# EAGLE schematic doan (EAGLE 9.2.2)
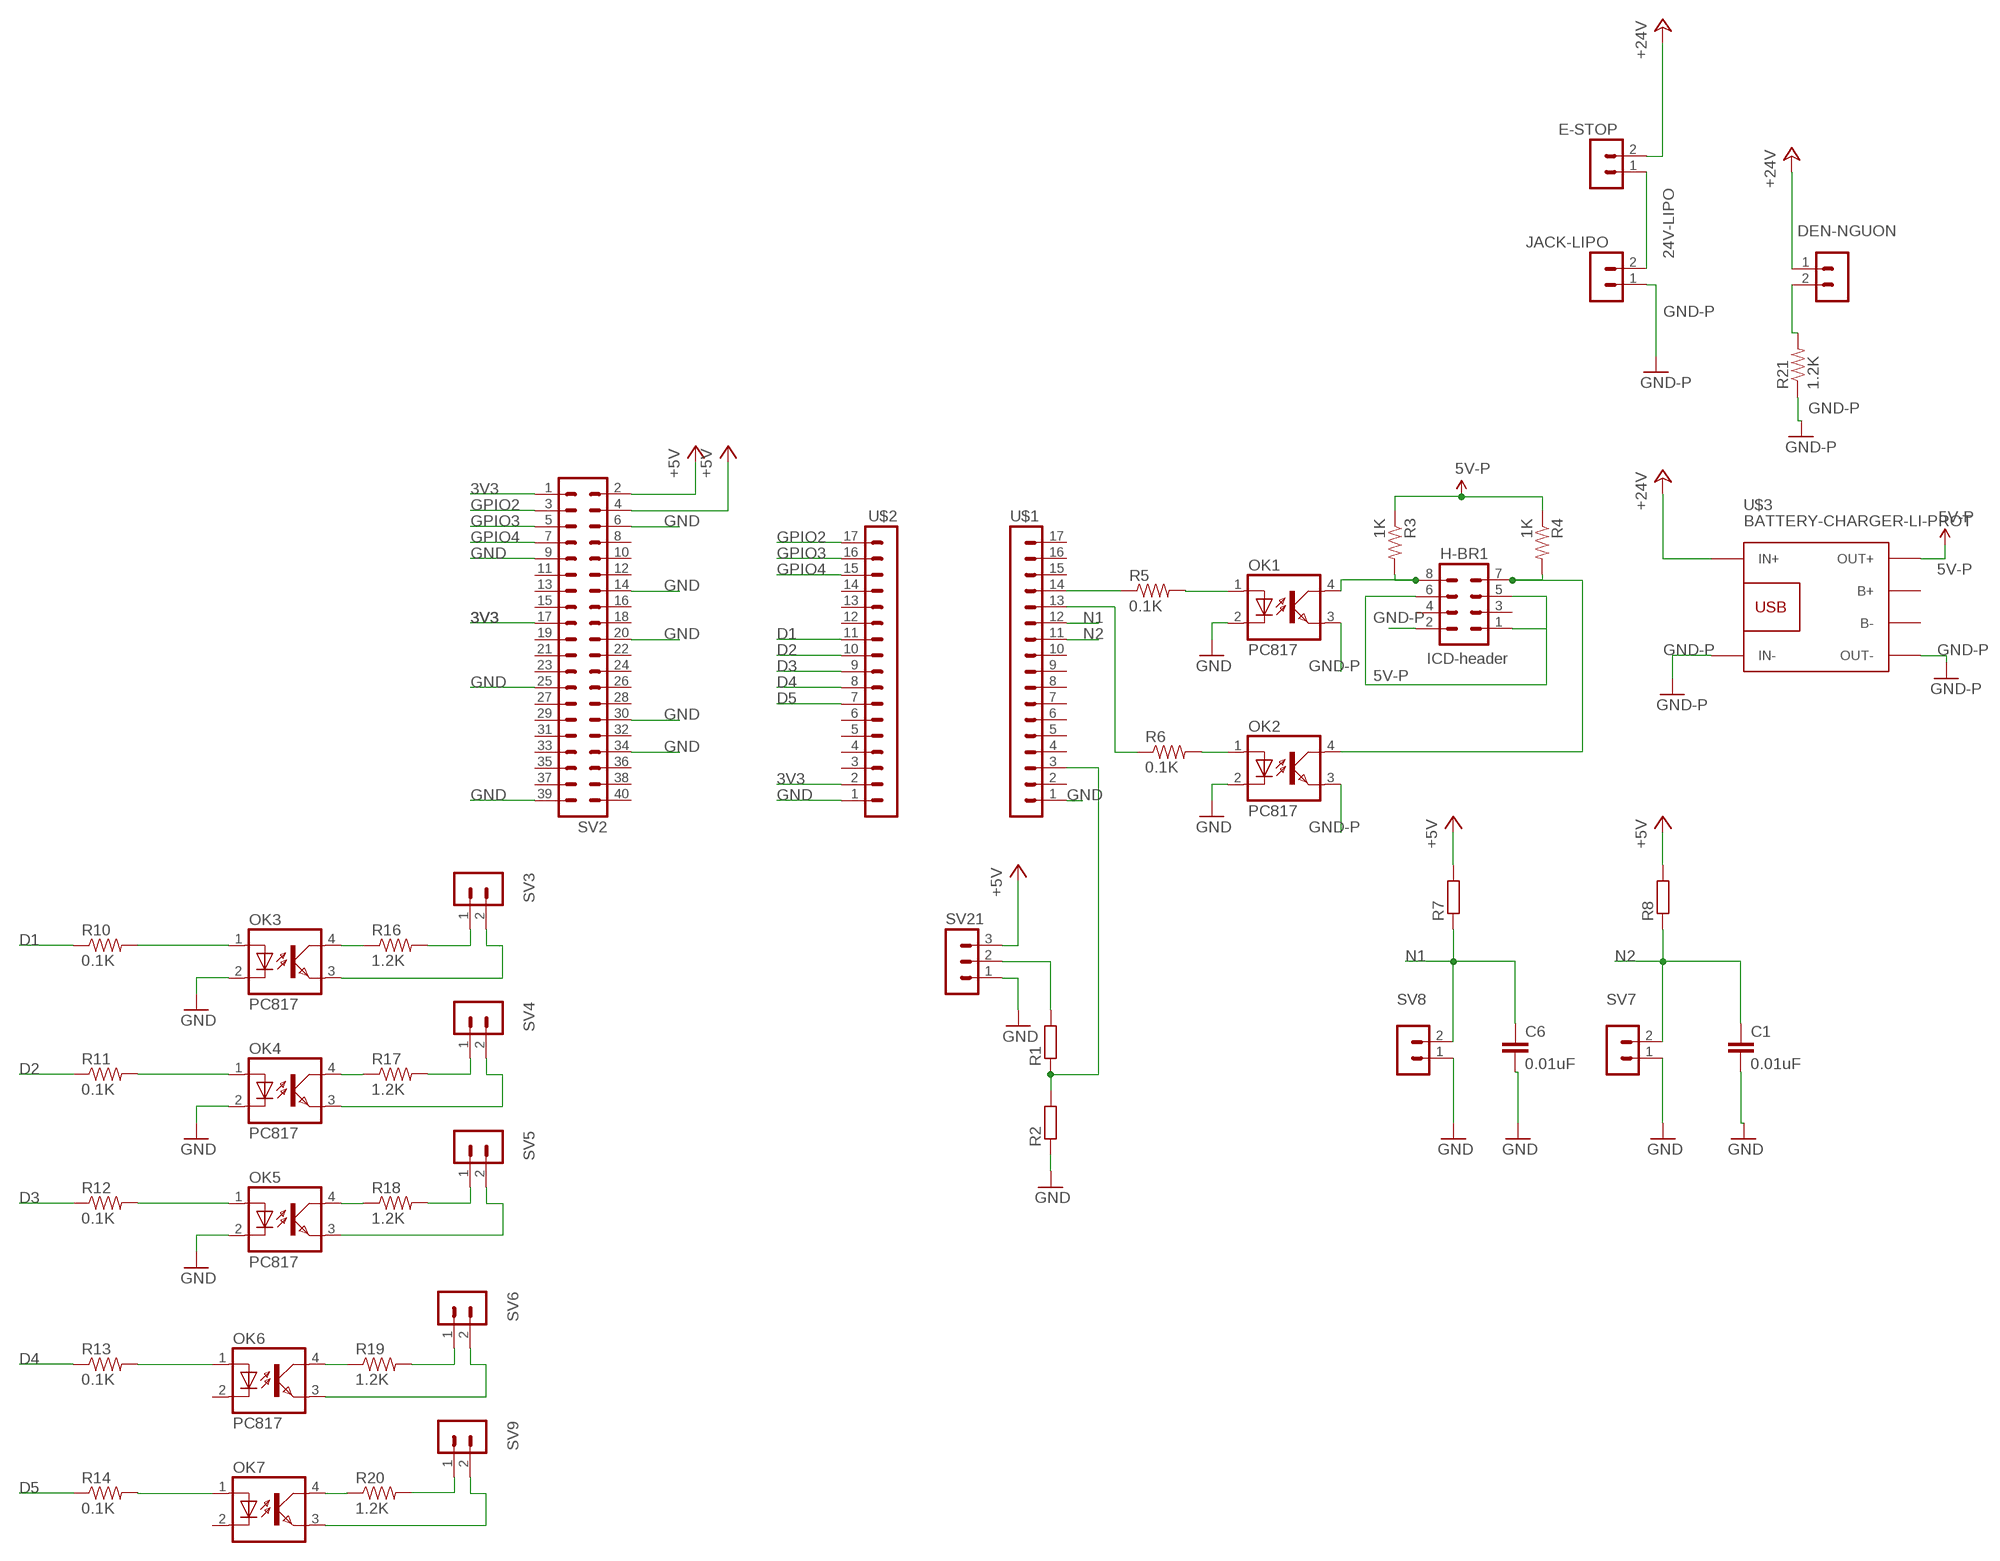
[diagram p0: schematic, sheet 1]

## Parts
C1  0.01uF  10UF10V10%(0805)  [0805-CAP]
C6  0.01uF  10UF10V10%(0805)  [0805-CAP]
DEN-NGUON  MA02-1  [MA02-1]
E-STOP  MA02-1  [MA02-1]
H-BR1  MA04-2  [MA04-2]
JACK-LIPO  MA02-1  [MA02-1]
OK1  PC817  [DIL04]
OK2  PC817  [DIL04]
OK3  PC817  [DIL04]
OK4  PC817  [DIL04]
OK5  PC817  [DIL04]
OK6  PC817  [DIL04]
OK7  PC817  [DIL04]
R1  R-EU_0309/10  [0309/10]
R2  R-EU_0309/10  [0309/10]
R3  1K  0.3OHM-1/8W-1%(0805)  [0805]
R4  1K  0.3OHM-1/8W-1%(0805)  [0805]
R5  0.1K  0.3OHM-1/8W-1%(0805)  [0805]
R6  0.1K  0.3OHM-1/8W-1%(0805)  [0805]
R7  R-EU_0309/10  [0309/10]
R8  R-EU_0309/10  [0309/10]
R10  0.1K  0.3OHM-1/8W-1%(0805)  [0805]
R11  0.1K  0.3OHM-1/8W-1%(0805)  [0805]
R12  0.1K  0.3OHM-1/8W-1%(0805)  [0805]
R13  0.1K  0.3OHM-1/8W-1%(0805)  [0805]
R14  0.1K  0.3OHM-1/8W-1%(0805)  [0805]
R16  1.2K  0.3OHM-1/8W-1%(0805)  [0805]
R17  1.2K  0.3OHM-1/8W-1%(0805)  [0805]
R18  1.2K  0.3OHM-1/8W-1%(0805)  [0805]
R19  1.2K  0.3OHM-1/8W-1%(0805)  [0805]
R20  1.2K  0.3OHM-1/8W-1%(0805)  [0805]
R21  1.2K  0.3OHM-1/8W-1%(0805)  [0805]
SV2  MA20-2W  [MA20-2W]
SV3  MA02-1  [MA02-1]
SV4  MA02-1  [MA02-1]
SV5  MA02-1  [MA02-1]
SV6  MA02-1  [MA02-1]
SV7  MA02-1  [MA02-1]
SV8  MA02-1  [MA02-1]
SV9  MA02-1  [MA02-1]
SV21  MA03-1  [MA03-1]
U$1  MA17-1  [MA17-1]
U$2  MA17-1  [MA17-1]
U$3  BATTERY-CHARGER-LI-PROT  [BATTERY-CHARGER-LI-PROT]

## Nets
3V3: SV2.1 SV2.17 U$2.2
5V-P: H-BR1.1 H-BR1.5 H-BR1.6 R3.1 R4.1 U$3.OUT+
24V-LIPO: E-STOP.1 JACK-LIPO.2
+5V: R7.2 R8.2 SV2.2 SV2.4 SV21.3
+24V: DEN-NGUON.1 E-STOP.2 U$3.IN+
D1: R10.1 U$2.11
D2: R11.1 U$2.10
D3: R12.1 U$2.9
D4: R13.1 U$2.8
D5: R14.1 U$2.7
GND: C1.2 C6.2 OK1.2(C) OK2.2(C) OK3.2(C) OK4.2(C) OK5.2(C) R2.1 SV2.6 SV2.9 SV2.14 SV2.20 SV2.25 SV2.30 SV2.34 SV2.39 SV7.1 SV8.1 SV21.1 U$1.1 U$2.1
GND-P: H-BR1.2 JACK-LIPO.1 OK1.3(EMIT) OK2.3(EMIT) R21.1 U$3.IN- U$3.OUT-
GPIO2: SV2.3 U$2.17
GPIO3: SV2.5 U$2.16
GPIO4: SV2.7 U$2.15
N1: C6.1 R7.1 SV8.2 U$1.12
N2: C1.1 R8.1 SV7.2 U$1.11
N$1: R1.1 R2.2 U$1.3
N$2: R5.1 U$1.14
N$3: OK2.1(A) R6.2
N$4: OK1.1(A) R5.2
N$5: R6.1 U$1.13
N$6: OK3.1(A) R10.2
N$7: OK4.1(A) R11.2
N$8: OK5.1(A) R12.2
N$9: OK6.1(A) R13.2
N$10: OK7.1(A) R14.2
N$12: R1.2 SV21.2
N$13: H-BR1.8 OK1.4(COL) R3.2
N$14: H-BR1.7 OK2.4(COL) R4.2
N$15: OK3.4(COL) R16.1
N$16: R16.2 SV3.1
N$17: OK3.3(EMIT) SV3.2
N$18: OK4.4(COL) R17.1
N$19: R17.2 SV4.1
N$20: OK4.3(EMIT) SV4.2
N$21: OK5.4(COL) R18.1
N$22: R18.2 SV5.1
N$23: OK5.3(EMIT) SV5.2
N$24: R21.2
N$25: R19.2 SV6.1
N$27: OK7.4(COL) R20.1
N$28: R20.2 SV9.1
N$29: OK7.3(EMIT) SV9.2
N$30: OK6.3(EMIT) SV6.2
N$31: DEN-NGUON.2
N$32: OK6.4(COL) R19.1
Unconnected: H-BR1.3 H-BR1.4 OK6.2(C) OK7.2(C) SV2.8 SV2.10 SV2.11 SV2.12 SV2.13 SV2.15 SV2.16 SV2.18 SV2.19 SV2.21 SV2.22 SV2.23 SV2.24 SV2.26 SV2.27 SV2.28 SV2.29 SV2.31 SV2.32 SV2.33 SV2.35 SV2.36 SV2.37 SV2.38 SV2.40 U$1.2 U$1.4 U$1.5 U$1.6 U$1.7 U$1.8 U$1.9 U$1.10 U$1.15 U$1.16 U$1.17 U$2.3 U$2.4 U$2.5 U$2.6 U$2.12 U$2.13 U$2.14 U$3.B+ U$3.B-

## Notes on the sheet
- ICD-header

## Library data of the parts
C1 C6 = SparkFun-Capacitors:10UF10V10%(0805): CAP-11330; PROD_ID: CAP-11330
DEN-NGUON E-STOP JACK-LIPO SV3-SV9 = MA02-1:MA02-1: PIN HEADER
H-BR1 = con-lstb:MA04-2: PIN HEADER; OC_FARNELL: unknown; OC_NEWARK: unknown
OK1-OK7 = optocoupler:PC817: SHARP OPTO COUPLER; MPN: PC817X4J000F; OC_FARNELL: 9707727; OC_NEWARK: 97K7059
R1 R2 R7 R8 = rcl:R-EU_: RESISTOR, European symbol; SPICEPREFIX: R
R3-R6 R10-R14 R16-R21 = SparkFun-Resistors:0.3OHM-1/8W-1%(0805): RES-11622; PROD_ID: RES-11622; VALUE: 0.3
SV2 = con-lstb:MA20-2W: PIN HEADER; OC_FARNELL: unknown; OC_NEWARK: unknown
SV21 = con-lstb:MA03-1: PIN HEADER; OC_FARNELL: unknown; OC_NEWARK: unknown
U$1 U$2 = MA17-1:MA17-1
U$3 = diy-modules:BATTERY-CHARGER-LI-PROT: Lithium Battery 5V Charger with protection circuit More details available here: http://www.instructables.com/id/DIY-Lithium-ion-Battery-Charger/step4/TP4056-based-lithium-ion-battery-charger-module/ Click here to find device on ebay.com <http://www.ebay.com/sch/tp4056+charger+usb+protection>